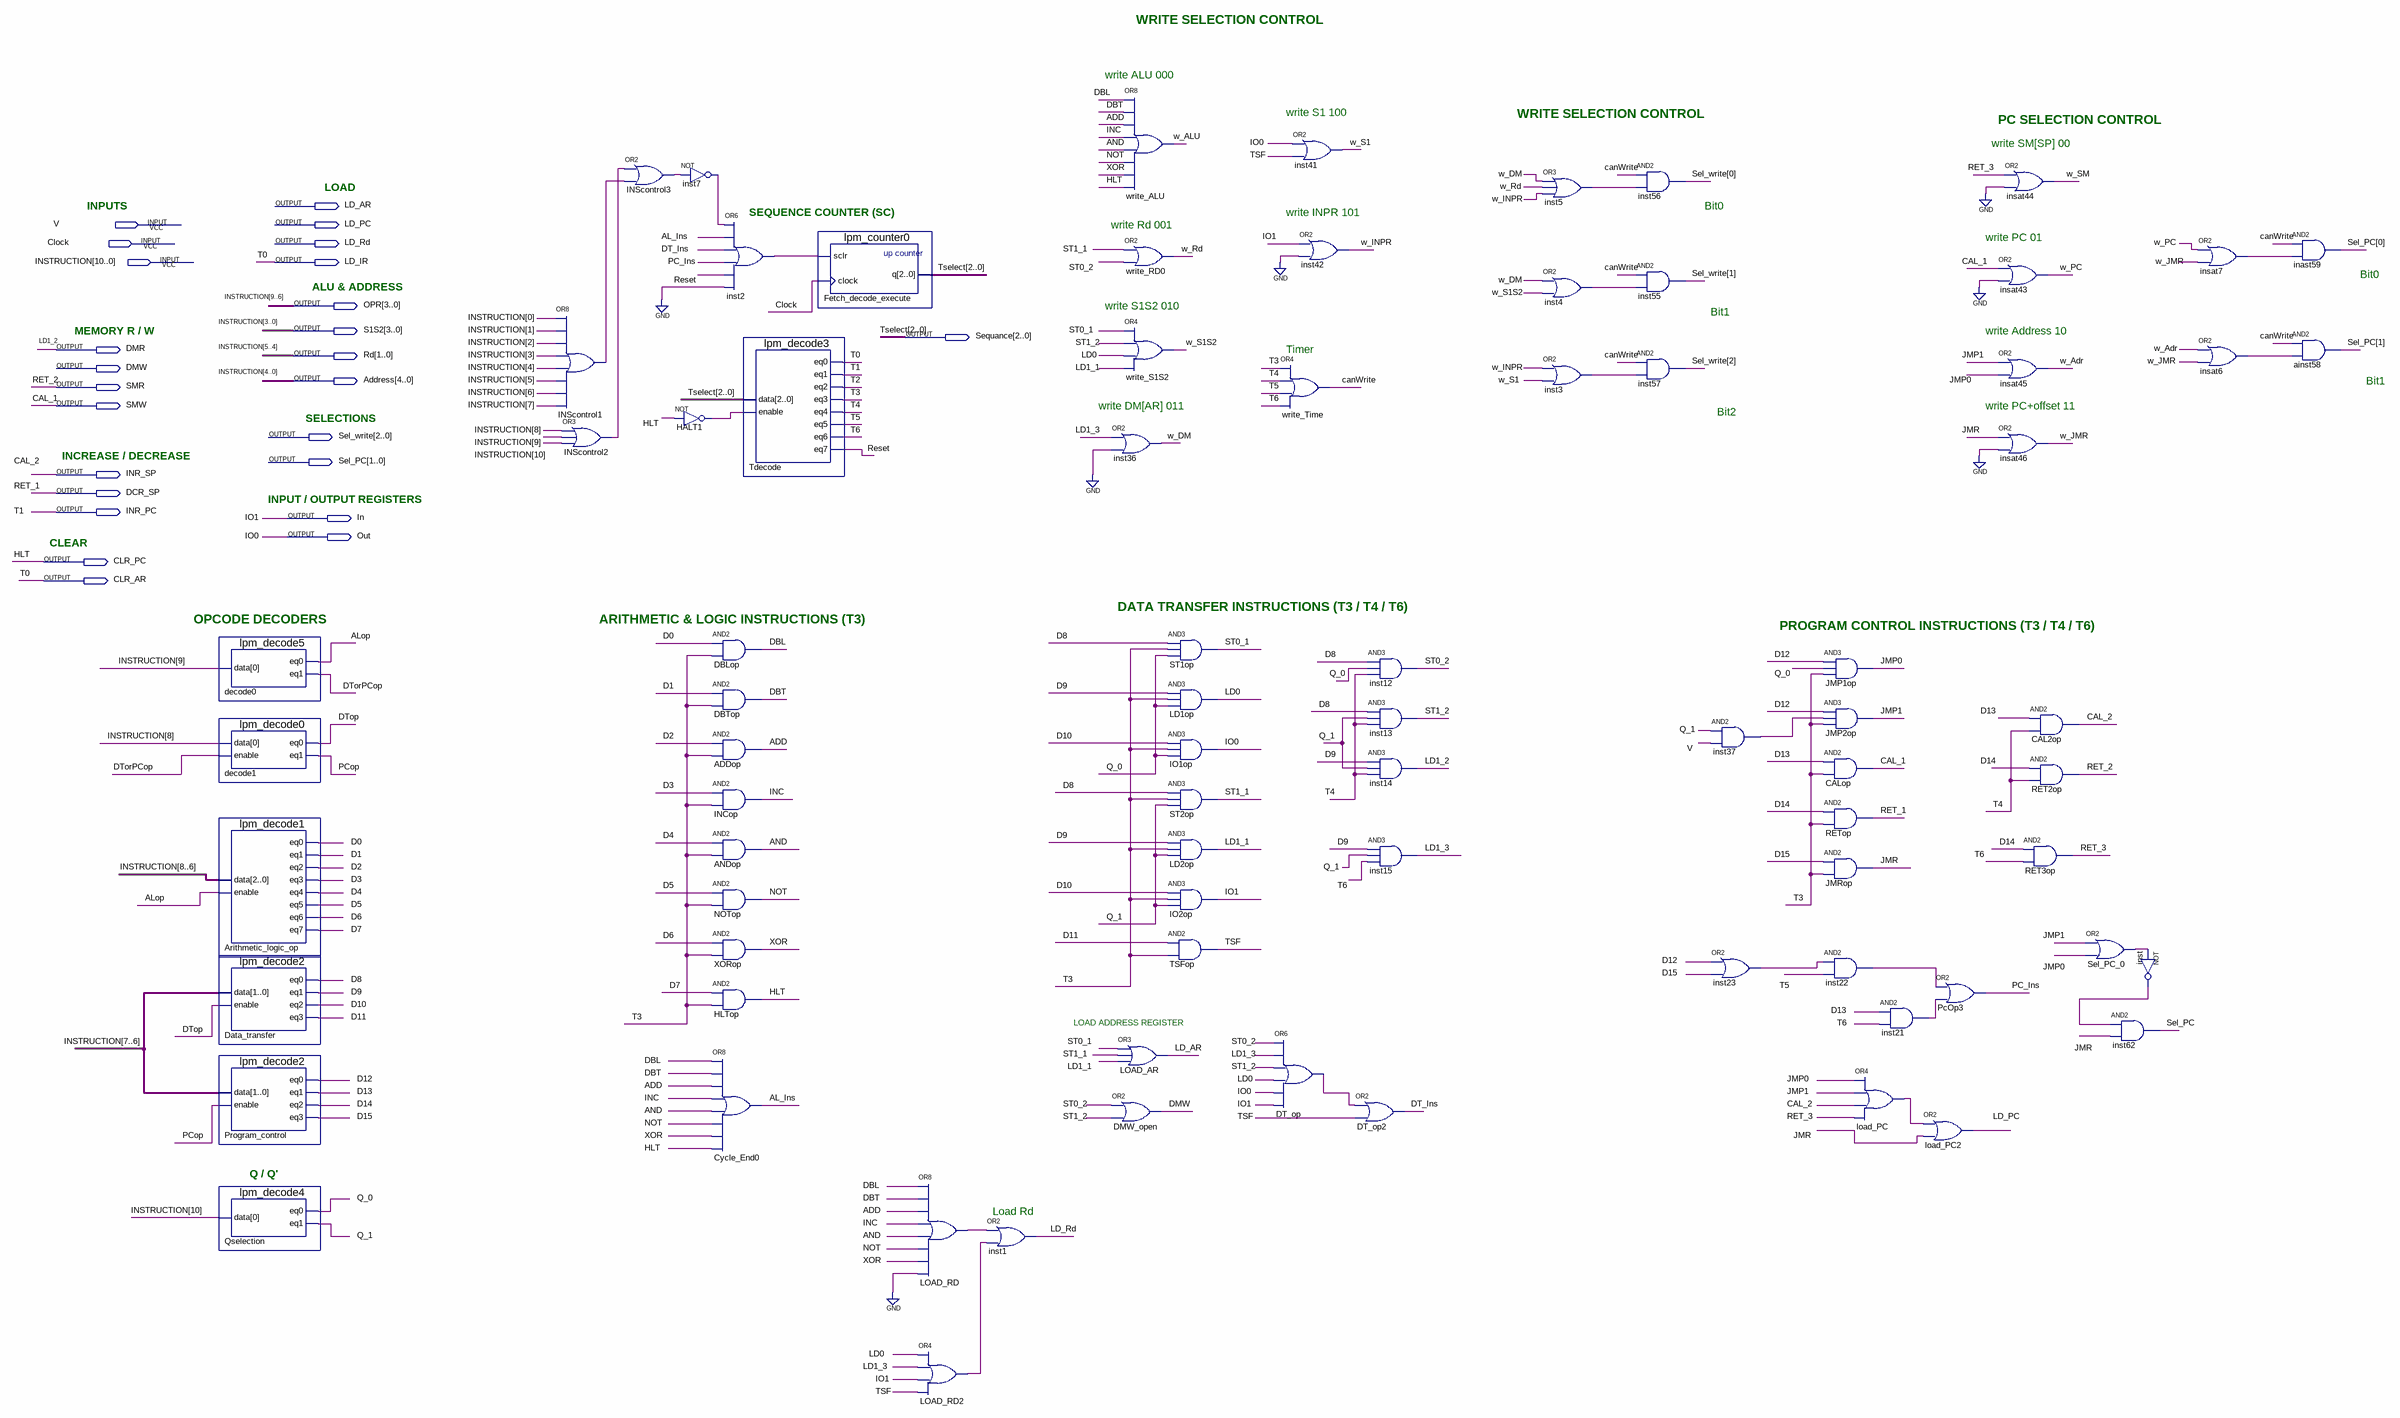
[diagram p0: schematic sheet]
// Quartus schematic 2019510083_Ata_Can_Yaymaci_Control_Unit.bdf as structural Verilog: 80 symbols, 25 pins
module \2019510083_Ata_Can_Yaymaci_Control_Unit  (
  input  V,
  input  Clock,
  input  [10:0] INSTRUCTION,
  output LD_AR,
  output LD_PC,
  output LD_Rd,
  output LD_IR,
  output [3:0] OPR,
  output [3:0] S1S2,
  output [2:0] Sequance,
  output DMR,
  output [1:0] Rd,
  output DMW,
  output [4:0] Address,
  output SMR,
  output SMW,
  output [2:0] Sel_write,
  output [1:0] Sel_PC,
  output INR_SP,
  output DCR_SP,
  output INR_PC,
  output In,
  output Out,
  output CLR_PC,
  output CLR_AR
);

  wire ADD, AL_Ins, ALop, AND, canWrite, D0, D1, D2, D3, D4, D5, D6, D7, D8, D9, D10, D11, D12, D13, D14,
       D15, DBL, DBT, DT_Ins, DT_op_out, DTop, DTorPCop, HALT1_out, INC, insat6_out, insat7_out,
       INScontrol1_out, INScontrol2_out, INScontrol3_out, inst2_out, inst3_out, inst4_out, inst5_out,
       inst7_out, inst21_out, inst22_out, inst23_out, inst37_out, inst_out, JMP0, JMP1, JMR, LD0, LD1_1,
       LD1_3, load_PC_out, LOAD_RD2_out, LOAD_RD_out, NOT, PC_Ins, PCop, Q_0, Q_1, Reset, RET_3,
       Sel_PC_0_out, Sel_PC_1bit, ST0_1, ST0_2, ST1_1, ST1_2, T2, T3, T4, T5, T6, TSF, w_Adr, w_ALU, w_DM,
       w_INPR, w_JMR, w_PC, w_Rd, w_S1, w_S1S2, w_SM, XOR;

  lpm_decode5 decode0 (.data(INSTRUCTION[9]), .eq0(ALop), .eq1(DTorPCop));
  lpm_decode0 decode1 (.data(INSTRUCTION[8]), .enable(DTorPCop), .eq0(DTop), .eq1(PCop));
  lpm_decode1 Arithmetic_logic_op (
    .data(INSTRUCTION[8:6]), .enable(ALop), .eq0(D0), .eq1(D1), .eq2(D2), .eq3(D3), .eq4(D4), .eq5(D5),
    .eq6(D6), .eq7(D7));
  lpm_decode2 Data_transfer (.data(INSTRUCTION[7:6]), .enable(DTop), .eq0(D8), .eq1(D9), .eq2(D10), .eq3(D11));
  lpm_decode2 Program_control (.data(INSTRUCTION[7:6]), .enable(PCop), .eq0(D12), .eq1(D13), .eq2(D14), .eq3(D15));
  lpm_decode4 Qselection (.data(INSTRUCTION[10]), .eq0(Q_0), .eq1(Q_1));
  or INScontrol1 (INScontrol1_out, INSTRUCTION[0], INSTRUCTION[1], INSTRUCTION[2], INSTRUCTION[3], INSTRUCTION[4], INSTRUCTION[5], INSTRUCTION[6], INSTRUCTION[7]);
  or INScontrol2 (INScontrol2_out, INSTRUCTION[8], INSTRUCTION[9], INSTRUCTION[10]);
  or INScontrol3 (INScontrol3_out, INScontrol2_out, INScontrol1_out);
  not inst7 (inst7_out, INScontrol3_out);
  not HALT1 (HALT1_out, CLR_PC);
  or inst2 (inst2_out, inst7_out, AL_Ins, DT_Ins, PC_Ins, Reset, 1'b0);
  lpm_decode3 Tdecode (
    .data(Sequance), .enable(HALT1_out), .eq0(CLR_AR), .eq1(INR_PC), .eq2(T2), .eq3(T3), .eq4(T4), .eq5(T5),
    .eq6(T6), .eq7(Reset));
  and DBLop (DBL, D0, T3);
  and DBTop (DBT, D1, T3);
  and ADDop (ADD, D2, T3);
  and INCop (INC, D3, T3);
  and ANDop (AND, D4, T3);
  and NOTop (NOT, D5, T3);
  and XORop (XOR, D6, T3);
  and HLTop (CLR_PC, D7, T3);
  or Cycle_End0 (AL_Ins, DBL, DBT, ADD, INC, AND, NOT, XOR, CLR_PC);
  lpm_counter0 Fetch_decode_execute (.sclr(inst2_out), .clock(Clock), .q(Sequance));
  or LOAD_RD (LOAD_RD_out, DBL, DBT, ADD, INC, AND, NOT, XOR, 1'b0);
  or LOAD_RD2 (LOAD_RD2_out, LD0, LD1_3, In, TSF);
  or inst1 (LD_Rd, LOAD_RD_out, LOAD_RD2_out);
  or write_ALU (w_ALU, DBL, DBT, ADD, INC, AND, NOT, XOR, CLR_PC);
  or write_RD0 (w_Rd, ST1_1, ST0_2);
  or write_S1S2 (w_S1S2, ST0_1, ST1_2, LD0, LD1_1);
  or inst36 (w_DM, LD1_3, 1'b0);
  or LOAD_AR (LD_AR, ST0_1, ST1_1, LD1_1);
  or DMW_open (DMW, ST0_2, ST1_2);
  and ST1op (ST0_1, D8, T3, Q_0);
  and LD1op (LD0, D9, T3, Q_0);
  and IO1op (Out, D10, T3, Q_0);
  and ST2op (ST1_1, D8, T3, Q_1);
  and LD2op (LD1_1, D9, T3, Q_1);
  and IO2op (In, D10, T3, Q_1);
  and TSFop (TSF, D11, T3);
  or inst41 (w_S1, Out, TSF);
  or inst42 (w_INPR, In, 1'b0);
  or write_Time (canWrite, T3, T4, T5, T6);
  or DT_op (DT_op_out, ST0_2, LD1_3, ST1_2, LD0, Out, In);
  or DT_op2 (DT_Ins, DT_op_out, TSF);
  and inst12 (ST0_2, D8, Q_0, T4);
  and inst13 (ST1_2, D8, Q_1, T4);
  and inst14 (DMR, D9, Q_1, T4);
  and inst15 (LD1_3, D9, Q_1, T6);
  or inst5 (inst5_out, w_DM, w_Rd, w_INPR);
  or inst4 (inst4_out, w_DM, w_S1S2);
  or inst3 (inst3_out, w_INPR, w_S1);
  and inst56 (Sel_write[0], canWrite, inst5_out);
  and inst55 (Sel_write[1], canWrite, inst4_out);
  and inst57 (Sel_write[2], canWrite, inst3_out);
  and inst37 (inst37_out, Q_1, V);
  or inst23 (inst23_out, D12, D15);
  and JMP1op (JMP0, D12, Q_0, T3);
  and JMP2op (JMP1, D12, inst37_out, T3);
  and CALop (SMW, D13, T3);
  and RETop (DCR_SP, D14, T3);
  and JMRop (JMR, D15, T3);
  and inst22 (inst22_out, inst23_out, T5);
  or load_PC (load_PC_out, JMP0, JMP1, INR_SP, RET_3);
  and inst21 (inst21_out, D13, T6);
  or PcOp3 (PC_Ins, inst22_out, inst21_out);
  or load_PC2 (LD_PC, load_PC_out, JMR);
  or insat44 (w_SM, RET_3, 1'b0);
  or insat43 (w_PC, SMW, 1'b0);
  or insat45 (w_Adr, JMP1, JMP0);
  or insat46 (w_JMR, JMR, 1'b0);
  and CAL2op (INR_SP, D13, T4);
  and RET2op (SMR, D14, T4);
  and RET3op (RET_3, D14, T6);
  or Sel_PC_0 (Sel_PC_0_out, JMP1, JMP0);
  not inst (inst_out, Sel_PC_0_out);
  and inst62 (Sel_PC_1bit, inst_out, JMR);
  or insat7 (insat7_out, w_PC, w_JMR);
  or insat6 (insat6_out, w_Adr, w_JMR);
  and inast59 (Sel_PC[0], canWrite, insat7_out);
  and ainst58 (Sel_PC[1], canWrite, insat6_out);

  assign Address = INSTRUCTION[4:0];
  assign LD_IR = CLR_AR;
  assign OPR = INSTRUCTION[9:6];
  assign Rd = INSTRUCTION[5:4];
  assign S1S2 = INSTRUCTION[3:0];

  // Other names for the same wires on the sheet: CAL_1 = SMW; CAL_2 = INR_SP; HLT = CLR_PC; IO0 = Out; IO1 = In;
  //   LD1_2 = DMR; RET_1 = DCR_SP; RET_2 = SMR; T0 = CLR_AR; T1 = INR_PC; Tselect[2:0] = Sequance

  // Notes on the sheet:
  //   WRITE SELECTION CONTROL
  //   write ALU 000
  //   write S1 100
  //   WRITE SELECTION CONTROL
  //   PC SELECTION CONTROL
  //   write SM[SP] 00
  //   LOAD
  //   INPUTS
  //   Bit0
  //   SEQUENCE COUNTER (SC)
  //   write INPR 101
  //   write Rd 001
  //   write PC 01
  //   Bit0
  //   ALU & ADDRESS
  //   write S1S2 010
  //   Bit1
  //   MEMORY R / W
  //   write Address 10
  //   Timer
  //   Bit1
  //   write DM[AR] 011
  //   write PC+offset 11
  //   Bit2
  //   SELECTIONS
  //   INCREASE / DECREASE
  //   INPUT / OUTPUT REGISTERS
  //   CLEAR
  //   DATA TRANSFER INSTRUCTIONS (T3 / T4 / T6)
  //   OPCODE DECODERS
  //   ARITHMETIC & LOGIC INSTRUCTIONS (T3)
  //   PROGRAM CONTROL INSTRUCTIONS (T3 / T4 / T6)
  //   LOAD ADDRESS REGISTER
  //   Q / Q'
  //   Load Rd
endmodule
